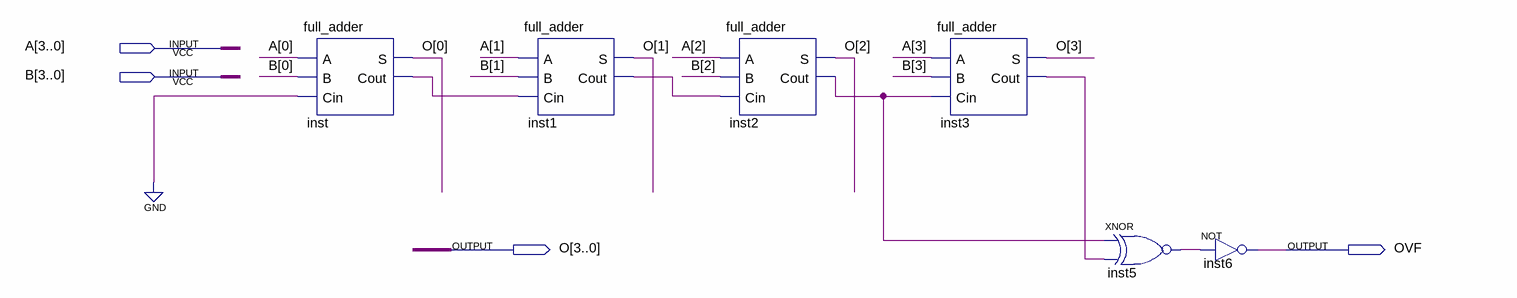
[diagram p0: schematic sheet]
// Quartus schematic FA_4bits.bdf as structural Verilog: 6 symbols, 4 pins
module FA_4bits (
  input  [3:0] A,
  input  [3:0] B,
  output [3:0] O,
  output OVF
);

  wire inst1_cout, inst2_cout, inst3_cout, inst5_out, inst_cout;

  full_adder inst (.A(A[0]), .B(B[0]), .Cin(1'b0), .S(O[0]), .Cout(inst_cout));
  full_adder inst1 (.A(A[1]), .B(B[1]), .Cin(inst_cout), .S(O[1]), .Cout(inst1_cout));
  full_adder inst2 (.A(A[2]), .B(B[2]), .Cin(inst1_cout), .S(O[2]), .Cout(inst2_cout));
  full_adder inst3 (.A(A[3]), .B(B[3]), .Cin(inst2_cout), .S(O[3]), .Cout(inst3_cout));
  xnor inst5 (inst5_out, inst2_cout, inst3_cout);
  not inst6 (OVF, inst5_out);
endmodule
